# EAGLE schematic CurrentClampInterfaceCircuit (EAGLE 9.5.1)
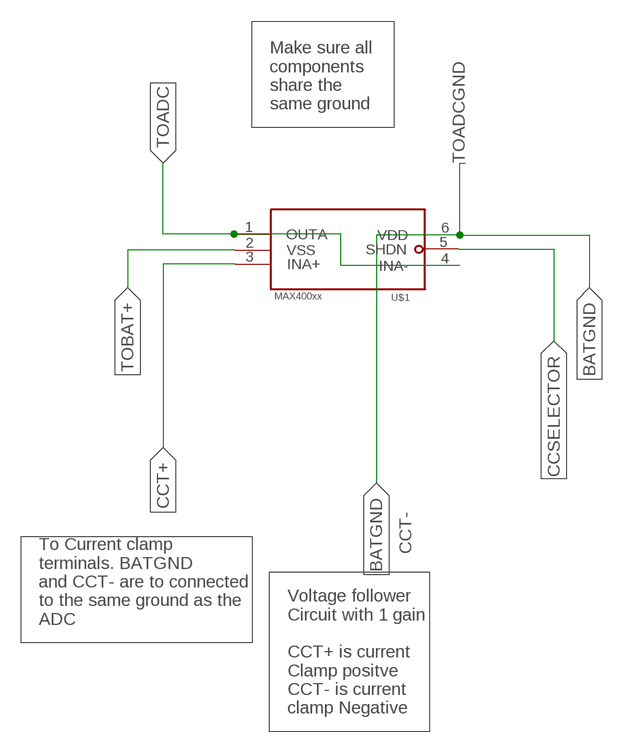
[diagram p0: schematic, sheet 1]

## Parts
U$1  SOT23-6LSMD  [MAX40079]

## Nets
BATGND: U$1.6(VDD)
CCSELECTOR: U$1.5(SHDN)
CCT+: U$1.3(INA+)
TOADC: U$1.1(OUTA) U$1.4(INA-)
TOBAT+: U$1.2(VSS)

## Notes on the sheet
- Make sure all
  components
  share the 
  same ground
- TOADCGND
- CCT-
- To Current clamp 
  terminals. BATGND 
  and CCT- are to connected
  to the same ground as the
  ADC
- Voltage follower
  Circuit with 1 gain
  
  CCT+ is current
  Clamp positve
  CCT- is current 
  clamp Negative

## Library data of the parts
U$1 = VoltagemeasurementComponents:SOT23-6L: Single/Dual/Quad Ultra-Low Input Bias Current, Low Noise Amplifiers Manufacturer- Maxim Integrated Circuit The MAX40079/MAX40087/MAX40077/MAX40089/ MAX40078 are wide band, low-noise, low-input bias current operational amplifiers that offer rail-to-rail outputs and single-supply operation from 2.7V to 5.5V. These lownoise amps draw 2.2mA of quiescent supply current per amplifier. This family of amplifiers offers ultra-low distortion (0.0002% THD+N), as well as low input voltage-noise density (4.2nV/√Hz) and low input current-noise density (0.5fA/√Hz). The low input bias current of 0.3pA (typ) and low noise(4.5nV/√Hz), together with the wide bandwidth, provides excellent performance for transimpedance (TIA) and imaging applications.